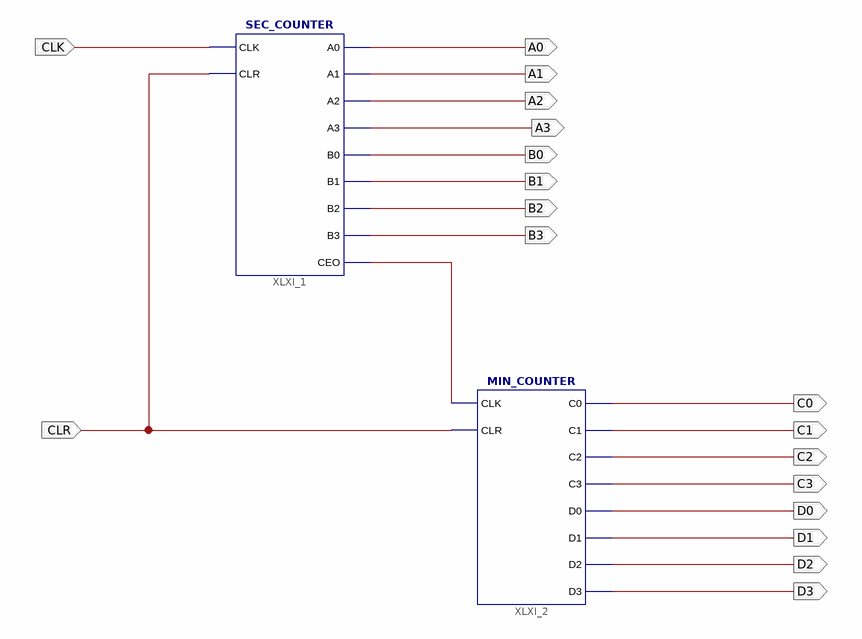
[diagram p0: schematic sheet 1]
// Xilinx ISE schematic Timer.sch (spartan6) as structural Verilog: 2 symbols, 18 ports
module Timer (
  input  CLR,
  input  CLK,
  output A0,
  output A1,
  output A2,
  output A3,
  output B0,
  output B1,
  output B2,
  output B3,
  output C0,
  output C1,
  output C2,
  output C3,
  output D0,
  output D1,
  output D2,
  output D3
);

  wire XLXN_1;

  SEC_COUNTER XLXI_1 (
    .A0(A0), .A1(A1), .A2(A2), .A3(A3), .B0(B0), .B1(B1), .B2(B2), .B3(B3), .CEO(XLXN_1), .CLK(CLK), .CLR(CLR));
  MIN_COUNTER XLXI_2 (.C0(C0), .C1(C1), .C2(C2), .C3(C3), .CLK(XLXN_1), .CLR(CLR), .D0(D0), .D1(D1), .D2(D2), .D3(D3));
endmodule
